# EAGLE design TickTagREV3 (EAGLE 9.5.2)
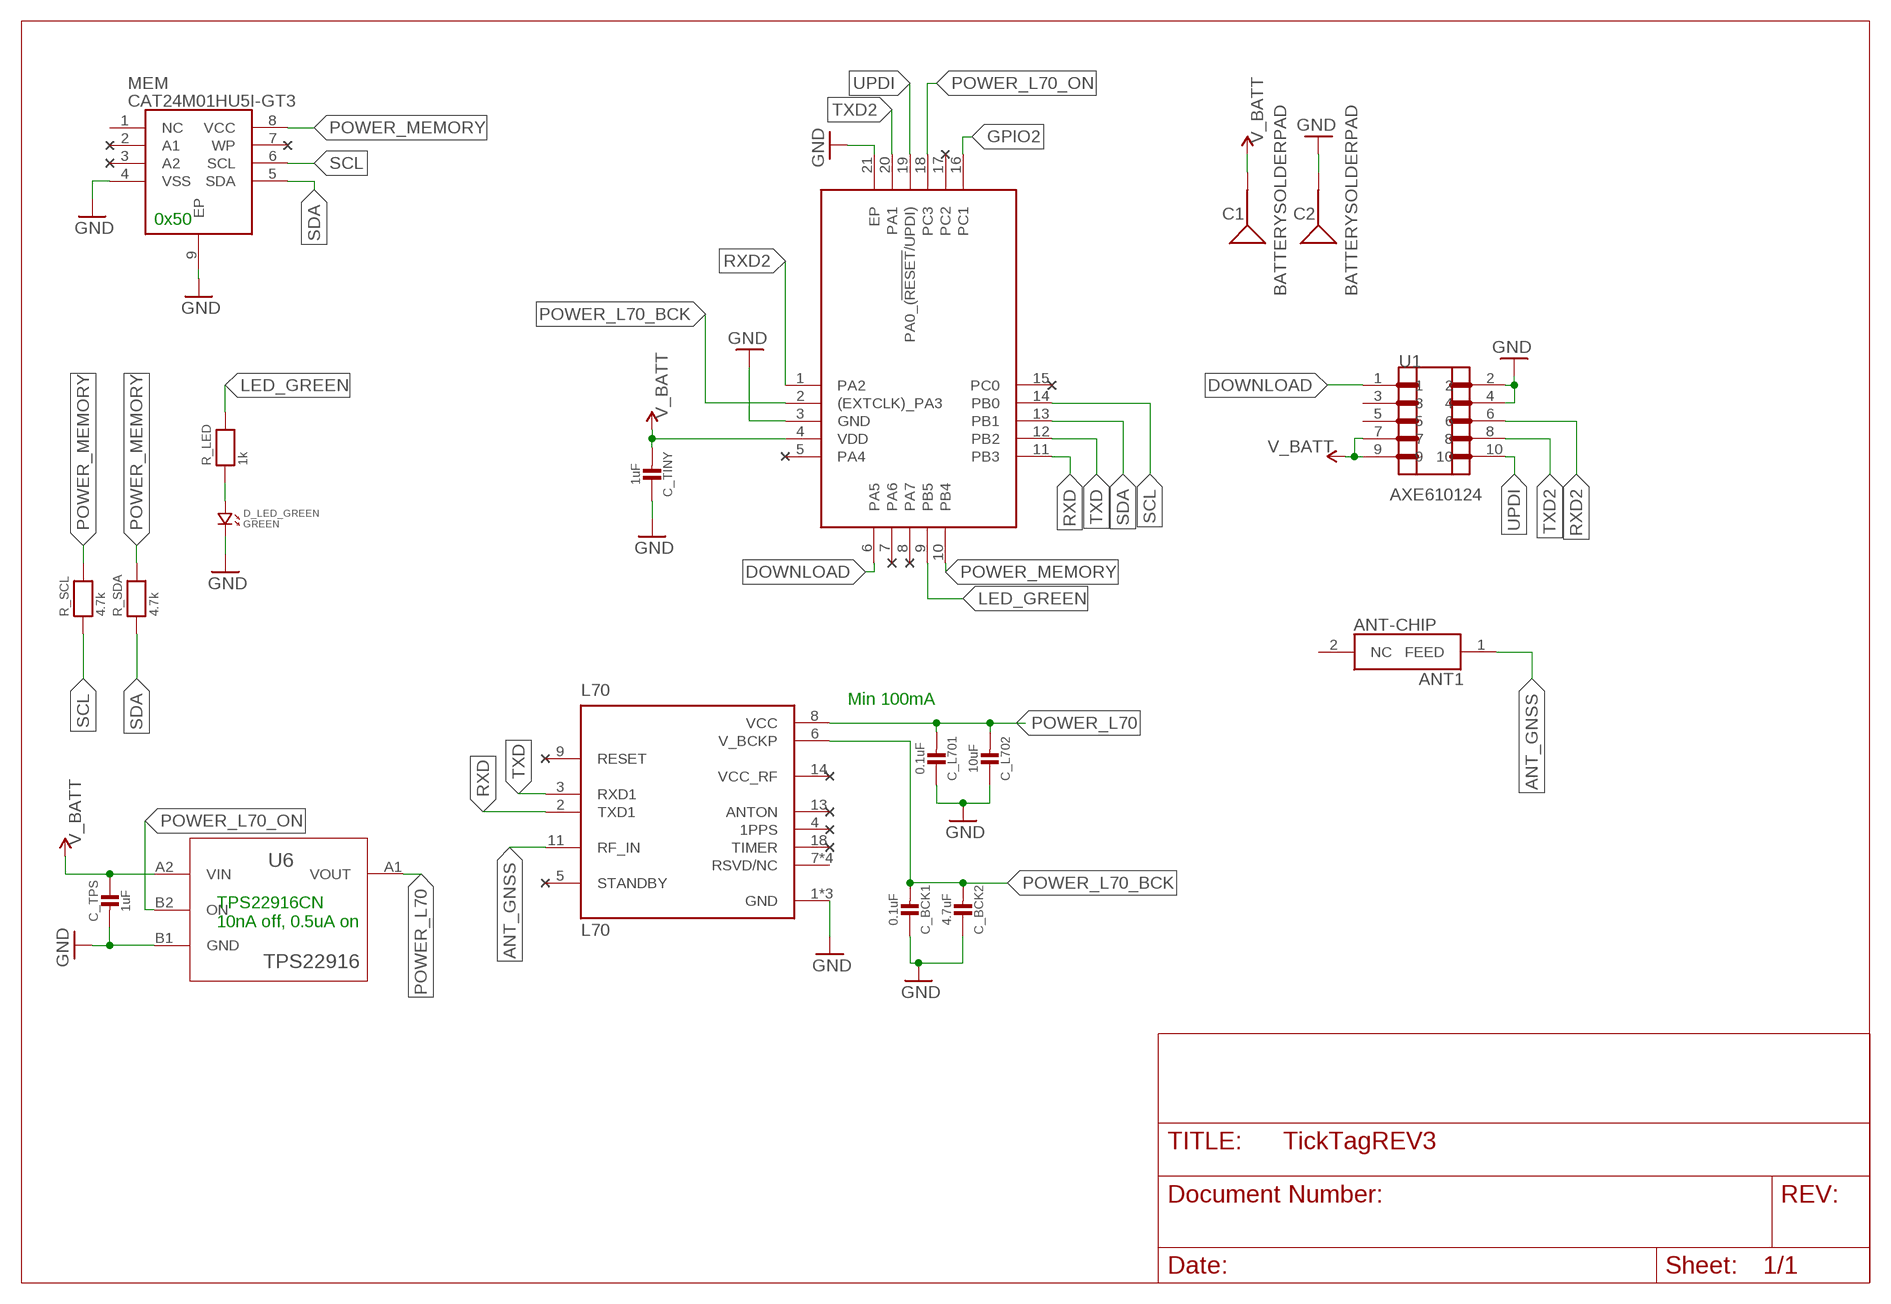
[diagram p0: schematic, sheet 1]

## Parts
ANT-CHIP  ANT1  SAMACSYS_PARTS_1575AT43A0040E  [SAMACSYS_PARTS_1575AT43A0040E]
ATTINY  ATTINY1616-MFR  [QFN40P300X300X90-21N]
C1  BATTERYSOLDERPAD  [BATTERYSOLDERPAD]
C2  BATTERYSOLDERPAD  [BATTERYSOLDERPAD]
C_BCK1  0.1uF  MICROBUILDER_CAP_CERAMIC_0402MP  [MICROBUILDER__0402MP]
C_BCK2  4.7uF  MICROBUILDER_CAP_CERAMIC_0402MP  [MICROBUILDER__0402MP]
C_L701  0.1uF  MICROBUILDER_CAP_CERAMIC_0402MP  [MICROBUILDER__0402MP]
C_L702  10uF  MICROBUILDER_CAP_CERAMIC_0402MP  [MICROBUILDER__0402MP]
C_TINY  1uF  MICROBUILDER_CAP_CERAMIC_0402MP  [MICROBUILDER__0402MP]
C_TPS  1uF  MICROBUILDER_CAP_CERAMIC_0402MP  [MICROBUILDER__0402MP]
D_LED_GREEN  GREEN  CMONR_STANDARDPARTS_LED.0402  [CMONR_STANDARDPARTS_0402.LED]
L70  L70  [XCVR_L70]
MEM  CAT24M01HU5I-GT3  [SON50P300X200X55-9N]
R_LED  1k  MICROBUILDER_RESISTOR_0402MP  [MICROBUILDER__0402MP]
R_SCL  4.7k  MICROBUILDER_RESISTOR_0402MP  [MICROBUILDER__0402MP]
R_SDA  4.7k  MICROBUILDER_RESISTOR_0402MP  [MICROBUILDER__0402MP]
U1  AXE610124  [AXE610124]
U6  TPS22916  [TPS22916]

## Nets
ANT_GNSS: ANT-CHIP.1(FEED) L70.11(RF_IN)
DOWNLOAD: ATTINY.6(PA5) U1.1
GND: ATTINY.3(GND) ATTINY.21(EP) C2.1(SIGNAL) C_BCK1.1 C_BCK2.1 C_L701.1 C_L702.1 C_TINY.1 C_TPS.2 D_LED_GREEN.P$2 L70.1(GND) L70.10(GND) L70.12(GND) MEM.4(VSS) MEM.9(EP) U1.2 U1.4 U6.B1(GND)
GPIO2: ATTINY.16(PC1)
LED_GREEN: ATTINY.9(PB5) R_LED.2
N$9: D_LED_GREEN.P$1 R_LED.1
POWER_L70: C_L701.2 C_L702.2 L70.8(VCC) U6.A1(VOUT)
POWER_L70_BCK: ATTINY.2((EXTCLK)_PA3) C_BCK1.2 C_BCK2.2 L70.6(V_BCKP)
POWER_L70_ON: ATTINY.18(PC3) U6.B2(ON)
POWER_MEMORY: ATTINY.10(PB4) MEM.8(VCC) R_SCL.2 R_SDA.2
RXD: ATTINY.11(PB3) L70.2(TXD1)
RXD2: ATTINY.1(PA2) U1.6
SCL: ATTINY.14(PB0) MEM.6(SCL) R_SCL.1
SDA: ATTINY.13(PB1) MEM.5(SDA) R_SDA.1
TXD: ATTINY.12(PB2) L70.3(RXD1)
TXD2: ATTINY.20(PA1) U1.8
UPDI: ATTINY.19(PA0_(!RESET!/UPDI)) U1.10
V_BATT: ATTINY.4(VDD) C1.1(SIGNAL) C_TINY.2 C_TPS.1 U1.7 U1.9 U6.A2(VIN)
Unconnected: ANT-CHIP.2(NC) ATTINY.5(PA4) ATTINY.7(PA6) ATTINY.8(PA7) ATTINY.15(PC0) ATTINY.17(PC2) L70.4(1PPS) L70.5(STANDBY) L70.7(RSVD/NC) L70.9(RESET) L70.13(ANTON) L70.14(VCC_RF) L70.15(RSVD/NC) L70.16(RSVD/NC) L70.17(RSVD/NC) L70.18(TIMER) MEM.1(NC) MEM.2(A1) MEM.3(A2) MEM.7(WP) U1.3 U1.5

## Notes on the sheet
- 0x50
- Min 100mA
- TPS22916CN
  10nA off, 0.5uA on

## Library data of the parts
ANT-CHIP = 1575AT43A0040E_V2:SAMACSYS_PARTS_1575AT43A0040E: Tri-Band GPS, BDS, and GLNSS, Low Cost, Linearly Polarized, Omnidirectional Chip Antenna Source: Datasheet <https://componentsearchengine.com/Datasheets/1/1575AT43A0040E.pdf>; DESCRIPTION: Tri-Band GPS, BDS, and GLNSS, Low Cost, Linearly Polarized, Omnidirectional Chip Antenna; HEIGHT: mm; MANUFACTURER_NAME: JOHANSON TECHNOLOGY; MANUFACTURER_PART_NUMBER: 1575AT43A0040E; MOUSER_PART_NUMBER: 609-1575AT43A0040E; MOUSER_PRICE-STOCK: https://www.mouser.com/Search/Refine.aspx?Keyword=609-1575AT43A0040E
ATTINY = ATTINY1616-MFR:ATTINY1616-MFR: 8-bit Microcontrollers - MCU 20MHz, 16KB, VQFN20, Ind 125C, Green, T&R Source: Datasheet <http://ww1.microchip.com/downloads/en/DeviceDoc/ATtiny806_1606_Data_Sheet_40002029A.pdf>; DESCRIPTION: 8-bit Microcontrollers - MCU 20MHz, 16KB, VQFN20, Ind 125C, Green, T&R; HEIGHT: 0.9mm; MANUFACTURER_NAME: Microchip; MANUFACTURER_PART_NUMBER: ATTINY1606-MFR; MOUSER_PART_NUMBER: 556-ATTINY1606-MFR; MOUSER_PRICE-STOCK: https://www.mouser.com/Search/Refine.aspx?Keyword=556-ATTINY1606-MFR
C1 C2 = BatterySolderPadSquareNoCream:BATTERYSOLDERPAD
C_BCK1 C_BCK2 C_L701 C_L702 C_TINY C_TPS = TinyPICO:MICROBUILDER_CAP_CERAMIC: Ceramic Capacitors For new designs, use the packages preceded by an '_' character since they are more reliable: The following footprints should be used on most boards: _0402 - Standard footprint for regular board layouts _0603 - Standard footprint for regular board layouts _0805 - Standard footprint for regular board layouts _1206 - Standard footprint for regular board layouts For extremely tight-pitch boards where space is at a premium, the following 'micro-pitch' footprints can be used (smaller pads, no silkscreen outline, etc.): _0402MP - Micro-pitch footprint for very dense/compact boards _0603MP - Micro-pitch footprint for very dense/compact boards _0805MP - Micro-pitch footprint for very dense/compact boards _1206MP - Micro-pitch footprint for very dense/compact boards
D_LED_GREEN = TinyPICO:CMONR_STANDARDPARTS_LED
L70 = L70LessCream:L70: GPS Module Check prices <https://snapeda.com/parts/L70/Quectel/view-part/?ref=eda>; AVAILABILITY: Bad; DESCRIPTION: L70, an SMD type module, brings the high performance of MTK positioning engine to the industrial applications with compact profile, ultra low power consumption and fast positioning capability.; MF: Quectel; MP: L70; PACKAGE: 2920 Quectel; PRICE: None
MEM = CAT24M01HU5I-GT3-CorrectedV2:CAT24M01HU5I-GT3: EEPROM 1MB I2C SERIAL EEPROM Source: Datasheet <http://www.onsemi.com/pub/Collateral/CAT24M01-D.PDF>; ALLIED_NUMBER: 70300250; ALLIED_PRICE-STOCK: http://www.alliedelec.com/on-semiconductor-cat24m01hu5i-gt3/70300250/; DESCRIPTION: EEPROM 1MB I2C SERIAL EEPROM; HEIGHT: 0.55mm; MANUFACTURER_NAME: ON Semiconductor; MANUFACTURER_PART_NUMBER: CAT24M01HU5I-GT3; MOUSER_PART_NUMBER: 863-CAT24M01HU5I-GT3; MOUSER_PRICE-STOCK: https://www.mouser.com/Search/Refine.aspx?Keyword=863-CAT24M01HU5I-GT3; RS_PART_NUMBER: 7814831P; RS_PRICE-STOCK: http://uk.rs-online.com/web/p/products/7814831P
R_LED R_SCL R_SDA = TinyPICO:MICROBUILDER_RESISTOR: Resistors 0402 - 0402 Surface Mount Package 22 Ohm 1% 1/16W [Digikey: 311-22.0LRTR-ND] 33 Ohm 5% 1/16W 1.0K 5% 1/16W 1.5K 5% 1/16W 2.0K 1% 1/16W 10.0K 1% 1/16W [Digikey: 311-10.0KLRTR-ND] 10.0K 5% 1/16W [Digikey: RMCF0402JT10K0TR-ND] 12.1K 1% 1/16W [Digikey: 311-22.0LRTR-ND] 100.0K 5% 1/16W 0603 - 0603 Surface Mount Package 0 Ohm 1/10 Watt 1% Resistor 15 Ohm 1/10 Watt 1% Resistor 33 Ohm 1/10 Watt 1% Resistor 49.9 Ohm 1/10 Watt 1% Resistor 100 Ohm 1/10 Watt 1% Resistor 150 Ohm 1/10 Watt 1% Resistor 240 Ohm 1/10 Watt 1% Resistor 390 Ohm 1/10 Watt 1% Resistor 560 Ohm 1/10 Watt 1% Resistor 680 Ohm 1/10 Watt 1% Resistor 750 Ohm 1/10 Watt 1% Resistor 1.0K Ohm 1/10 Watt 1% Resistor 1.5K Ohm 1/10 Watt 1% Resistor 2.0K Ohm 1/10 Watt 1% Resistor 2.2K Ohm 1/10 Watt 1% Resistor 3.3K Ohm 1/10 Watt 1% Resistor 4.7K Ohm 1/10 Watt 1% Resistor 10.0K Ohm 1/10 Watt 1% Resistor 12.0K Ohm 1/10 Watt 1% Resistor 12.1K Ohm 1/10 Watt 1% Resistor 20.0K Ohm 1/10 Watt 1% Resistor 33.0K Ohm 1/10 Watt 1% Resistor 100.0K Ohm 1/10 Watt 1% Resistor 0805 - 0805 Surface Mount Package 0 Ohm 1/8 Watt 1% Resistor 33 Ohm 1/8 Watt 1% Resistor 100 Ohm 1/8 Watt 1% Resistor 150 Ohm 1/8 Watt 1% Resistor 200 Ohm 1/8 Watt 1% Resistor 240 Ohm 1/8 Watt 1% Resistor 330 Ohm 1/8 Watt 1% Resistor 390 Ohm 1/8 Watt 1% Resistor 470 Ohm 1/8 Watt 1% Resistor 1.0K Ohm 1/8 Watt 1% Resistor 1.5K Ohm 1/8 Watt 1% Resistor 2.0K Ohm 1/8 Watt 1% Resistor 4.7K Ohm 1/8 Watt 1% Resistor 5.1K Ohm 1/8 Watt 1% Resistor 5.6K Ohm 1/8 Watt 1% Resistor 10.0K Ohm 1/8 Watt 1% Resistor 22.0K Ohm 1/8 Watt 1% Resistor 33.0K Ohm 1/8 Watt 1% Resistor 100K Ohm 1/8 Watt 1% Resistor 1206 - 1206 Surface Mount Package 2012 - 2010 Surface Mount Package 0.11 Ohm 1/2 Watt 1% Resistor - Digikey: RHM.11UCT-ND
U1 = PanasonicA4SConnectorsV7:AXE610124
U6 = TPS22916V2:TPS22916: Linear Regulator; AVAILABILITY: Unavailable; DESCRIPTION: Linear Voltage Regulator IC 1 Output 150mA 4-DSBGA (1x1); MF: Texas Instruments; MP: LP5900TL-3.0; PACKAGE: WFBGA-4 Texas Instruments; PRICE: None

## Board
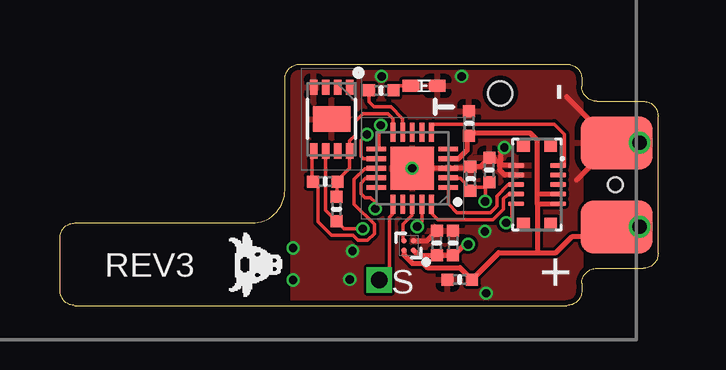
[diagram p1: board, top side]
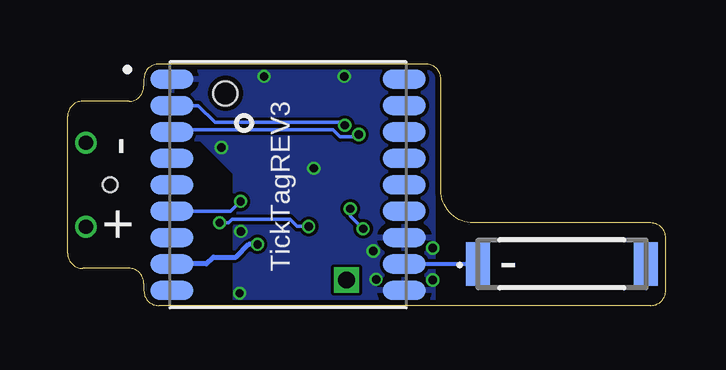
[diagram p2: board, bottom side, seen from below]

Size 24.94 x 10.06 mm. Coordinates in mm from the lower left corner, seen from the top.
Outline: 10,10.06 21.14,10.06 arc-90 21.76,9.44 21.76,9.13 arc90 22.38,8.51 24.32,8.51 arc-90 24.94,7.89 24.94,2.17 arc-90 24.32,1.55 22.38,1.55 arc90 21.76,0.93 21.76,0.62 arc-90 21.14,0 0.62,0 arc-90 0,0.62 0,2.82 arc-90 0.62,3.44 8.01,3.44 arc90 9.38,4.81 9.38,9.44 arc-90 10,10.06
Copper layers (1*16): Top 0.0356mm / dielectric 0.1702mm / Bottom 0.0356mm
Design rules "default *": minimum track width 5mil, minimum drill 0.35mm, track to track 5mil, track to pad 5mil, pad to pad 5mil, via to via 5mil, smd to smd 5mil, copper to edge 9mil, drill to drill 6mil, minimum pad ring 4mil, minimum via ring 4mil, stop-mask expansion 0mil, vias tented up to drill 0.35mm, thermal gap 10mil
Holes 0.6 mm at 23.16,5.03
Holes 1 mm at 18.36,8.84

### Footprints (pad centres in the part's own frame; a part is rotated, then mirrored left to right if it is on the bottom)
SAMACSYS_PARTS_1575AT43A0040E = smd 1 x 1.8: 1 3.5,0; 2 -3.5,0
QFN40P300X300X90-21N = smd 0.8 x 0.2: 1 -1.5,0.8; 2 -1.5,0.4; 3 -1.5,0; 4 -1.5,-0.4; 5 -1.5,-0.8; 11 1.5,-0.8; 12 1.5,-0.4; 13 1.5,0; 14 1.5,0.4; 15 1.5,0.8 | smd 0.2 x 0.8: 6 -0.8,-1.5; 7 -0.4,-1.5; 8 0,-1.5; 9 0.4,-1.5; 10 0.8,-1.5; 16 0.8,1.5; 17 0.4,1.5; 18 0,1.5; 19 -0.4,1.5; 20 -0.8,1.5 | smd 1.8 x 1.8: 21 0,0
BATTERYSOLDERPAD = smd 3 x 2.2: 1 0,0
MICROBUILDER__0402MP = smd 0.5 x 0.5: 1 -0.508,0; 2 0.508,0
CMONR_STANDARDPARTS_0402.LED = smd 0.7 x 0.5: P$1 -0.55,0; P$2 0.55,0
XCVR_L70 = smd 1.8 x 0.8: 1 -4.85,4.4; 2 -4.85,3.3; 3 -4.85,2.2; 4 -4.85,1.1; 5 -4.85,0; 6 -4.85,-1.1; 7 -4.85,-2.2; 8 -4.85,-3.3; 9 -4.85,-4.4; 10 4.85,-4.4; 11 4.85,-3.3; 12 4.85,-2.2; 13 4.85,-1.1; 14 4.85,0; 15 4.85,1.1; 16 4.85,2.2; 17 4.85,3.3; 18 4.85,4.4
SON50P300X200X55-9N = smd 0.63 x 0.32: 1 -1.33,0.75; 2 -1.33,0.25; 3 -1.33,-0.25; 4 -1.33,-0.75; 5 1.33,-0.75; 6 1.33,-0.25; 7 1.33,0.25; 8 1.33,0.75 | smd 1.06 x 1.56: 9 0,0
AXE610124 = smd 0.2 x 0.65: 1 0.81,-0.88; 2 0.81,0.87; 3 0.41,-0.88; 4 0.41,0.87; 5 0.01,-0.88; 6 0.01,0.87; 7 -0.39,-0.88; 8 -0.39,0.87; 9 -0.79,-0.88; 10 -0.79,0.87 | smd 0.45 x 0.53: DNC1 -1.59,0.57; DNC2 -1.59,-0.569; DNC3 1.607,-0.569; DNC4 1.607,0.57
TPS22916 = smd 0.23 x 0.23: A1 -0.254,0.254; A2 0.144,0.254; B1 -0.254,-0.144; B2 0.144,-0.144

### Placement (x,y rotation side)
ANT-CHIP  4.33,1.73 180 bottom
ATTINY  14.69,5.72 180 top
C1  23.21,3.28 0 top
C2  23.21,6.78 0 top
C_BCK1  17.9,5.64 270 top
C_BCK2  17.12,5.28 270 top
C_L701  16.39,2.6 270 top
C_L702  15.71,2.6 270 top
C_TINY  17.06,7.59 270 top
C_TPS  16.67,1.08 180 top
D_LED_GREEN  15.18,9.15 0 top
L70  15.75,5.03 0 bottom
MEM  11.33,7.77 270 top
R_LED  13.39,8.96 180 top
R_SCL  11.53,4.02 90 top
R_SDA  11.06,5.17 0 top
U1  19.89,5.03 90 top
U6  14.48,2.56 180 top

### Tracks (layer width: path | path; a pad name or v marks a point on that pad's centre or on a via)
ANT_GNSS
  Bottom 0.16: L70.11 ANT-CHIP.1
DOWNLOAD
  Top 0.152: ATTINY.6 15.49,7.48 15.57,7.56 20.61,7.56 21.03,7.14 21.03,5.87 21,5.84 U1.1
GND  (via drill 0.35, 0.6)
  Top 0.2: v14.68,5.72 ATTINY.3 17.05,5.72 C_BCK2.1 17.54,5.79 C_BCK1.1 18.1,6.15 18.27,5.98 18.35,5.98 18.35,5.84 | 18.35,5.84 U1.2 | U1.4 18.54,5.44 18.35,5.63 18.35,5.84 | 18.35,5.84 18.36,5.85 18.36,6.41 v18.53,6.58 | U6.B1 15.31,2.7 C_L702.1 | C2.1 23.04,6.78 21.12,8.7 | C2.1 23.09,6.78 21.55,5.24 | C2.1 v24.17,6.78
  other vias: 17.77,0.51 12.08,1.09 12.2,2.27 13.41,9.55 16.75,9.55 17.72,3.09 9.72,2.4 9.72,1.06
  pour Top: 9.67,10.59 9.67,-0.49 21.76,-0.49 21.76,10.59
  pour Bottom: 9.67,-0.38 9.67,10.59 20.62,10.59 20.62,7.77 19.76,6.91 19.4,6.91 17.98,5.49 17.98,-0.38
GPIO2  (via drill 0.7)
  Top 0.152: v13.31,1.06 13.73,1.48 13.73,3.67 13.87,3.81 13.87,4.2 ATTINY.16
LED_GREEN
  Top 0.152: ATTINY.9 14.29,7.79 13.8,8.28 13.1,8.28 12.89,8.49 R_LED.2
N$9
  Top 0.152: R_LED.1 14.09,9.15 D_LED_GREEN.P$1
POWER_L70  (via drill 0.35)
  Top 0.2: U6.A1 14.95,2.09 C_L701.2 C_L702.2 16.43,2.1 16.88,2.55 v17.02,2.55
  Bottom 0.2: v17.02,2.55 17.39,2.55 17.92,2.02 18.87,2.02 19.16,1.73 L70.8
POWER_L70_BCK  (via drill 0.35)
  Top 0.152: ATTINY.2 16.21,5.3 16.69,5.3 17.12,4.87 C_BCK2.2 17.27,4.92 17.69,4.92 C_BCK1.2 17.73,4.96 v17.73,4.34
  Bottom 0.152: v17.73,4.34 18.14,3.93 L70.6
POWER_L70_ON
  Top 0.152: ATTINY.18 14.67,4.2 14.67,3.76 14.3,3.39 14.3,2.74 U6.B2
POWER_MEMORY
  Top 0.152: ATTINY.10 13.89,7.79 13.68,8 12.64,8 12.32,7.68 12.32,7.1 12.08,6.87 MEM.8 12.07,5.72 11.52,5.17 R_SDA.2 R_SCL.2
RXD  (via drill 0.35)
  Top 0.152: v13.38,7.51 13.31,7.44 13.31,6.52 ATTINY.11
  Bottom 0.152: L70.2 19.49,8.33 18.79,7.63 13.5,7.63 v13.38,7.51
RXD2
  Top 0.152: ATTINY.1 16.19,4.23 16.56,3.86 17.94,3.86 18.21,4.13 18.21,4.56 18.68,5.03 U1.6
SCL  (via drill 0.35)
  Top 0.152: MEM.6 11.07,3.97 R_SCL.1 11.84,3.21 v12.61,3.21 v12.62,3.2 | v13.15,4.03 13.15,4.3 12.95,4.5 12.73,4.5 12.56,4.67 12.56,5.1 12.75,5.29 13.18,5.29 13.19,5.3 ATTINY.14
  Bottom 0.152: v13.15,4.03 13.15,3.73 v12.62,3.2
SDA
  Top 0.152: MEM.5 10.52,6.35 10.52,5.17 R_SDA.1 10.76,4.92 10.76,3.48 11.32,2.93 12.21,2.93 12.43,2.71 12.82,2.71 13.11,3 13.11,3.38 12.27,4.23 12.27,5.26 12.72,5.7 13.17,5.7 ATTINY.13
TXD  (via drill 0.35)
  Top 0.152: ATTINY.12 12.66,6.12 12.56,6.22 12.56,6.9 v12.8,7.12
  Bottom 0.152: v12.8,7.12 13.01,7.12 13.08,7.03 13.58,7.03 13.88,7.33 20.5,7.33 L70.3
TXD2
  Top 0.152: U1.8 18.69,4.64 18.49,4.44 18.49,4.02 18.05,3.57 15.77,3.57 15.49,3.85 ATTINY.20
UPDI  (via drill 0.35)
  Top 0.152: U1.10 18.85,4.24 18.85,3.69 v18.6,3.45 | ATTINY.19 15.09,3.5 v14.89,3.3
  Bottom 0.152: v14.89,3.3 15.37,3.3 15.67,3.6 18.07,3.6 18.22,3.45 v18.6,3.45
V_BATT  (via drill 0.6)
  Top 0.2: 19.9,4.24 19.9,2.2 | 19.9,4.24 U1.9 | 19.9,4.24 19.9,4.64 | 19.9,4.64 19.9,6.89 19.6,7.19 17.17,7.19 C_TINY.2 16.97,6.99 16.97,6.46 16.62,6.11 ATTINY.4 | U1.7 19.9,4.64 | U6.A2 14.34,2.11 14.69,1.76 15.14,1.76 15.32,1.58 16.68,1.58 C_TPS.1 18.3,2.2 19.9,2.2 | 19.9,2.2 20.68,2.2 21.34,2.86 22.79,2.86 C1.1 v24.17,3.28

### Text on the board
tNames: - | REV3 | S | +
bNames: - | + | - | TickTagREV3
tDocu: Ear-Tag Housing 22 x 35mm